# EAGLE design DS2482 1 Wire Controller Rev C (EAGLE 7.1.0)
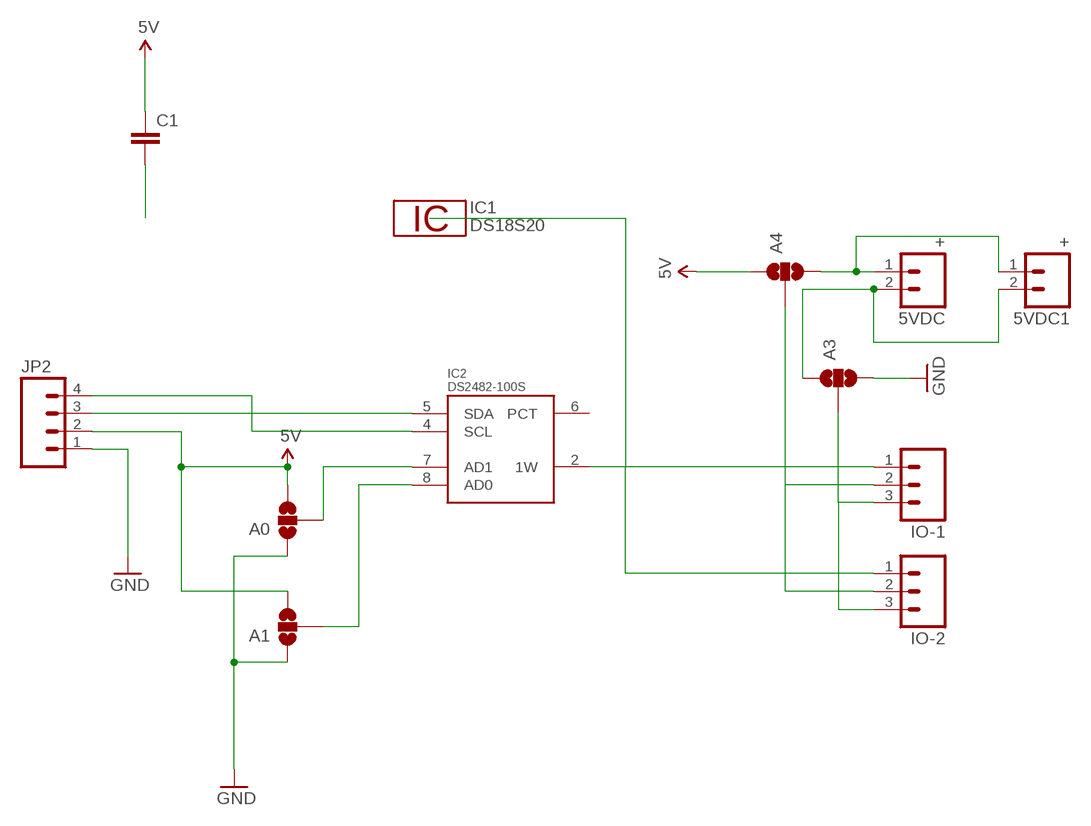
[diagram p0: schematic, sheet 1]

## Parts
5VDC  +  M02PTH  [1X02]
5VDC1  +  M02PTH  [1X02]
A0  SOLDERJUMPER_2WAYS  [SJ_3]
A1  SOLDERJUMPER_2WAYS  [SJ_3]
A3  SOLDERJUMPER_2WAYS  [SJ_3]
A4  SOLDERJUMPER_2WAYS  [SJ_3]
C1  CAPPTH2  [CAP-PTH-SMALL2]
IC1  DS18S20  [TO92-]
IC2  DS2482-100S  [SO08]
IO-1  M03PTH  [1X03]
IO-2  M03PTH  [1X03]
JP2  M04PTH  [1X04]

## Nets
1W: IC2.2(1W) IO-1.1 IO-2.1
5V: A0.3 A1.3 A4.1 C1.1 JP2.2
GND: A0.1 A1.1 A3.3 JP2.1
N$2: IC2.4(SCL) JP2.4
N$4: A0.2 IC2.7(AD1)
N$5: IC2.5(SDA) JP2.3
N$6: A3.2 IO-1.3 IO-2.3
N$7: A1.2 IC2.8(AD0)
N$19: A4.2 IO-1.2 IO-2.2
N$20: 5VDC1.1 5VDC.1 A4.3
N$21: 5VDC1.2 5VDC.2 A3.1
VDD: C1.2
Unconnected: IC2.6(PCT)

## Power pins joined to a net without a drawn wire
1W: IC1.2
GND: IC1.1 IC2.3(GND)
VDD: IC1.3 IC2.1(VDD)

## Library data of the parts
5VDC 5VDC1 = SparkFun-Connectors:M02: Standard 2-pin 0.1" header. Use with - straight break away headers ( PRT-00116) - right angle break away headers (PRT-00553) - swiss pins (PRT-00743) - machine pins (PRT-00117) - female headers (PRT-00115) Molex polarized connector foot print use with: PRT-08233 with associated crimp pins and housings. 2.54_SCREWTERM for use with PRT-10571. 3.5mm Screw Terminal footprints for PRT-08084 5mm Screw Terminal footprints for use with PRT-08432
A0 A1 A3 A4 = SparkFun-Retired:SOLDERJUMPER_2WAY: Solder Jumper 2 way solder jumper
C1 = SparkFun-Capacitors:CAP: Capacitor Standard 0603 ceramic capacitor, and 0.1" leaded capacitor.
IC1 = 1wire:DS18S20: High Precision Digital Thermometer This chip provides a onewire thermosensor with approx. 0.5°C accuracy.A programmable over/undertemperure alarm is available. Notes: Vdd must be applied for accurate measurements at low temperatures, as the parasite power circuit otherwise heats the sensor. If parasite power is used, Vdd has to be connected to GND. The DS1822 is a low-cost thermometer chip, the DS18B20 is similar to the DS18S20, but with 9..12 Bit programmable precision. Author: Jan Kandziora <jjj@gmx.de>
IC2 = 1wire:DS2482-100: I2C to 1-Wire Host Adapter/Line Driver This device is a onewire host and I2C interface in one chip. It provides the complete DC/AC requirements for onewire communication, including overdrive speed mode, but, unlike the DS2480B chip, no 12V EPROM programming. Notes: For overdrive speed and 5V EEPROM programming, an external active pullup circuit must be connected to the 1W, VDD and PCT pin. See the datasheet for details. The lower two I2C adress bits of the chip can be selected by external pins, so up to 4 chips may be connected to the same I2C bus. Author: Orginal device and description from Giovanni Varasano <giovanni.varasano@fastwebnet.it> Improved by Jan Kandziora <jjj@gmx.de>
IO-1 IO-2 = SparkFun-Connectors:M03: Header 3 Standard 3-pin 0.1" header. Use with straight break away headers (SKU : PRT-00116), right angle break away headers (PRT-00553), swiss pins (PRT-00743), machine pins (PRT-00117), and female headers (PRT-00115). Molex polarized connector foot print use with SKU : PRT-08232 with associated crimp pins and housings.
JP2 = SparkFun-Connectors:M04: Header 4 Standard 4-pin 0.1" header. Use with straight break away headers (SKU : PRT-00116), right angle break away headers (PRT-00553), swiss pins (PRT-00743), machine pins (PRT-00117), and female headers (PRT-00115). Molex polarized connector foot print use with SKU : PRT-08231 with associated crimp pins and housings. 1MM SMD Version SKU: PRT-10208

## Board
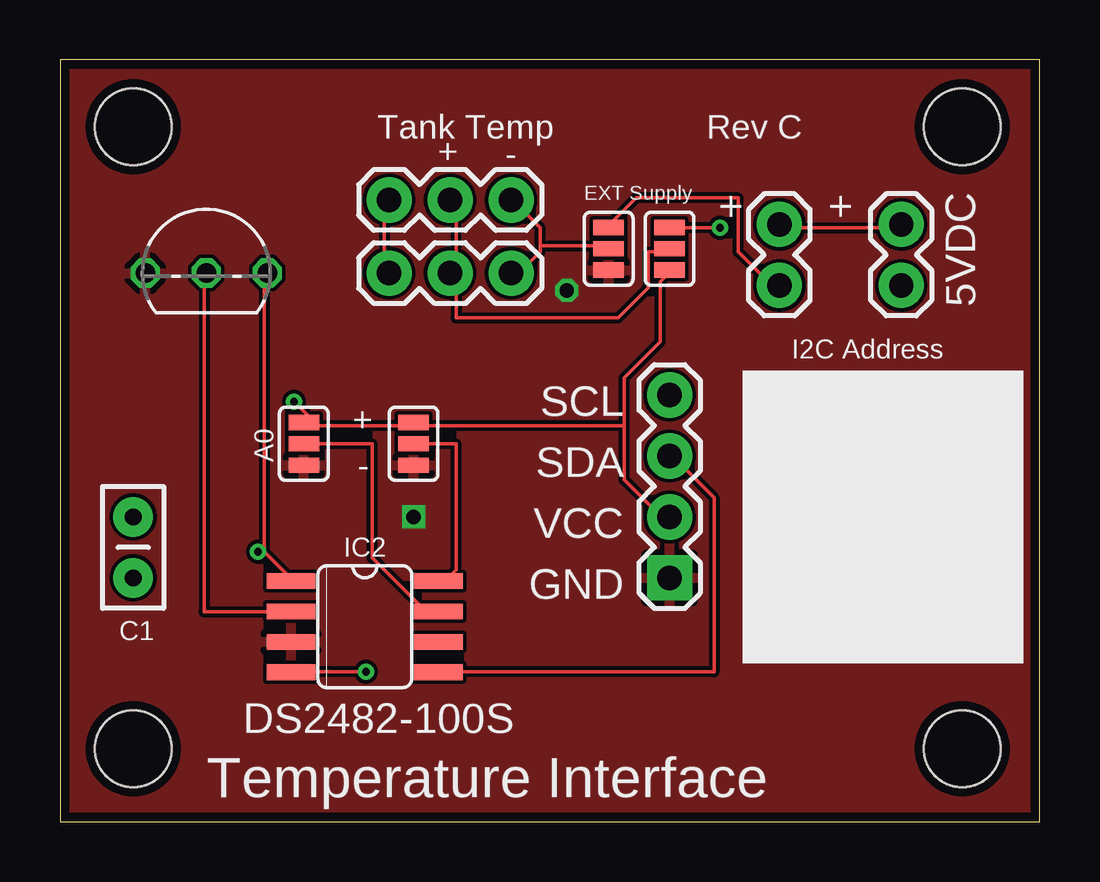
[diagram p1: board, top side]
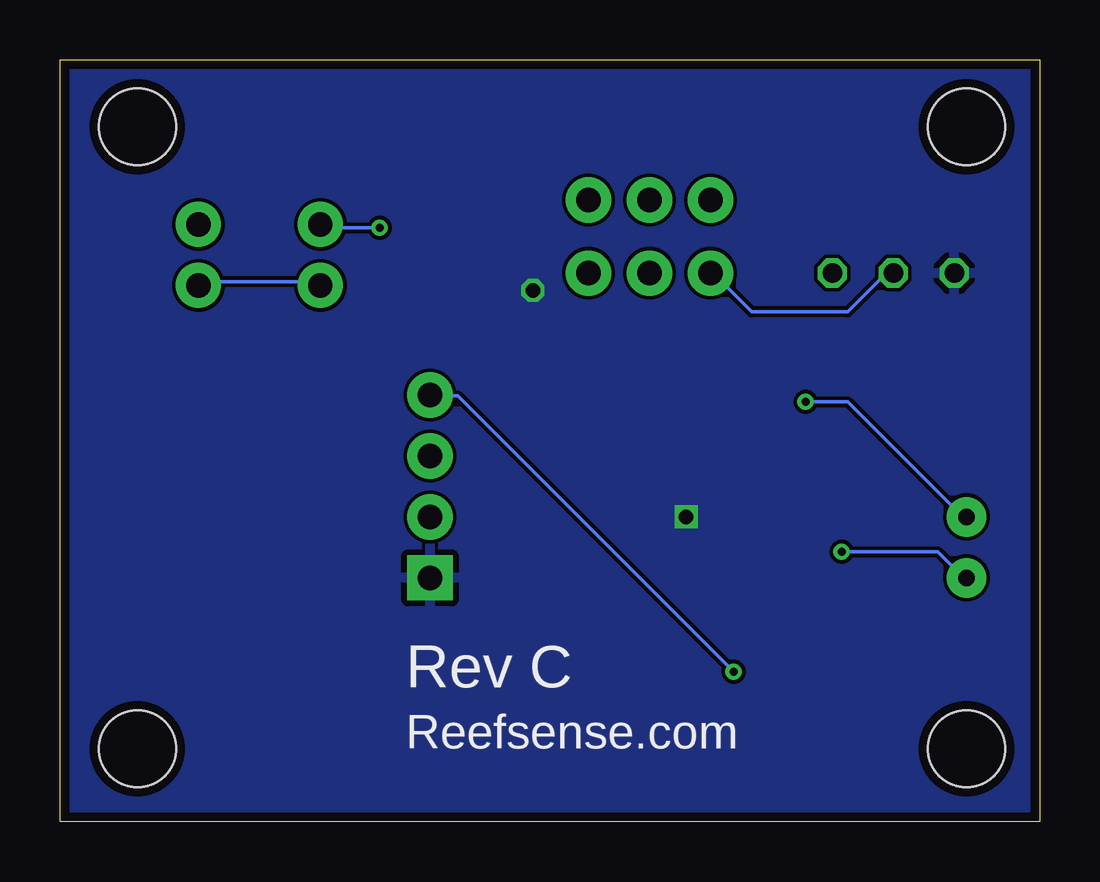
[diagram p2: board, bottom side, seen from below]

Size 40.82 x 31.74 mm. Coordinates in mm from the lower left corner, seen from the top.
Outline: 0,0 40.82,0 40.82,31.74 0,31.74 0,0
Copper layers (1*16): Top 0.0356mm / dielectric 1.5011mm / Bottom 0.0356mm
Design rules "LaenPCBOrder": minimum track width 6mil, minimum drill 13mil, track to track 6mil, track to pad 6mil, pad to pad 6mil, via to via 6mil, smd to smd 6mil, copper to edge 15mil, drill to drill 6mil, minimum pad ring 7mil, minimum via ring 7mil, stop-mask expansion 3mil, vias tented up to drill 0mil, thermal gap 10mil
Holes 3.2 mm at 3.05,28.96 37.59,28.96 3.05,3.05 37.59,3.05

### Footprints (pad centres in the part's own frame; a part is rotated, then mirrored left to right if it is on the bottom)
1X02 = drill 1.016 pad 1.88: 1 0,0; 2 2.54,0
SJ_3 = smd 0.635 x 1.27: 1 -0.889,0; 2 0,0; 3 0.889,0
CAP-PTH-SMALL2 = drill 0.7 pad 1.651: 1 0,0; 2 2.54,0
TO92- = drill 0.813 octagon: 1 -2.54,0; 2 0,0; 3 2.54,0
SO08 = smd 0.66 x 2.032: 1 -1.905,-3.073; 2 -0.635,-3.073; 3 0.635,-3.073; 4 1.905,-3.073; 5 1.905,3.073; 6 0.635,3.073; 7 -0.635,3.073; 8 -1.905,3.073
1X03 = drill 1.016 pad 1.88: 1 0,0; 2 2.54,0; 3 5.08,0
1X04 = drill 1.016 pad 1.88 square: 1 0,0 | drill 1.016 pad 1.88: 2 2.54,0; 3 5.08,0; 4 7.62,0

### Placement (x,y rotation side)
5VDC  35.05,24.89 270 top
5VDC1  29.97,24.89 270 top
A0  10.16,15.75 90 top
A1  14.73,15.75 90 top
A3  22.86,23.88 270 top
A4  25.4,23.88 90 top
C1  3.05,12.7 270 top
IC1  6.1,22.86 0 top
IC2  12.7,8.13 270 top
IO-1  13.72,22.86 0 top
IO-2  13.72,25.91 0 top
JP2  25.4,10.16 90 top

### Tracks (layer width: path | path; a pad name or v marks a point on that pad's centre or on a via)
1W
  Top 0.152: IO-1.1 13.5,23 13.5,25.75 IO-2.1 | IC2.2 9.5,8.75 6,8.75 6,22.75 IC1.2
  Bottom 0.152: IO-1.1 13.5,22.75 12,21.25 8,21.25 6.5,22.75 6.25,22.75 IC1.2
5V  (via drill 0.33)
  Top 0.152: 10.5,16.5 14.5,16.5 A1.3 14.75,16.5 23.5,16.5 | 10.5,16.5 10.25,16.5 A0.3 10.5,16.5 | 23.5,16.5 23.5,14.25 25.25,12.5 JP2.2 | 23.5,16.5 23.5,18.5 25,20 25,22.5 25.25,22.75 A4.1 | v9.75,17.5 10.5,16.75 10.5,16.5
  Bottom 0.152: v9.75,17.5 8,17.5 3.25,12.75 C1.1
GND  (via drill 0.6)
  other vias: 14.73,12.7 21.11,22.14
  pour Top: -1.52,35.05 59.44,38.61 59.94,-1.52 -1.02,-1.02
  pour Bottom: -1.02,-1.02 60.96,-2.03 60.45,37.59 -1.52,37.59
N$2  (via drill 0.33)
  Top 0.152: v12.75,6.25 9.75,6.25 IC2.4
  Bottom 0.152: v12.75,6.25 24.25,17.75 25.25,17.75 JP2.4
N$4
  Top 0.152: A0.2 10.25,15.75 13,15.75 13,11 15,9 15.75,9 IC2.7
N$5
  Top 0.152: IC2.5 16,6.25 27.25,6.25 27.25,13.5 25.5,15.25 JP2.3
N$6
  Top 0.152: 20,24 22.75,24 A3.2 | 20,24 20,23.75 19,22.75 IO-1.3 | 20,24 20,24.75 19,25.75 IO-2.3
N$7
  Top 0.152: A1.2 14.75,15.75 16.5,15.75 16.5,10.5 16,10 IC2.8
N$19
  Top 0.152: A4.2 25.25,23.75 24.5,23.75 24.5,22.25 23.25,21 16.5,21 16.5,22.75 IO-1.2 16.5,23 16.5,25.75 IO-2.2
N$20  (via drill 0.33)
  Top 0.152: v27.5,24.75 25.5,24.75 A4.3 | 5VDC.1 35,24.75 30,24.75 5VDC1.1
  Bottom 0.152: v27.5,24.75 29.75,24.75 5VDC1.1
N$21
  Top 0.152: A3.1 23,25 24,26 28.25,26 28.25,23.75 29.75,22.25 5VDC1.2
  Bottom 0.152: 5VDC.2 35,22.5 30,22.5 5VDC1.2
VDD  (via drill 0.33)
  Top 0.152: 8.5,11.25 9.5,10.25 IC2.1 | 8.5,11.25 8.5,22.75 IC1.3 | 8.5,11.25 v8.25,11.25
  Bottom 0.152: v8.25,11.25 4.25,11.25 3.25,10.25 C1.2

### Text on the board
tNames: Tank Temp | Rev C | + | - | EXT Supply | I2C Address | SCL | + | SDA | - | VCC | GND | Temperature Interface
bNames: Rev C | Reefsense.com